# EAGLE design Attenumults_Rev 6 (EAGLE 8.2.2)
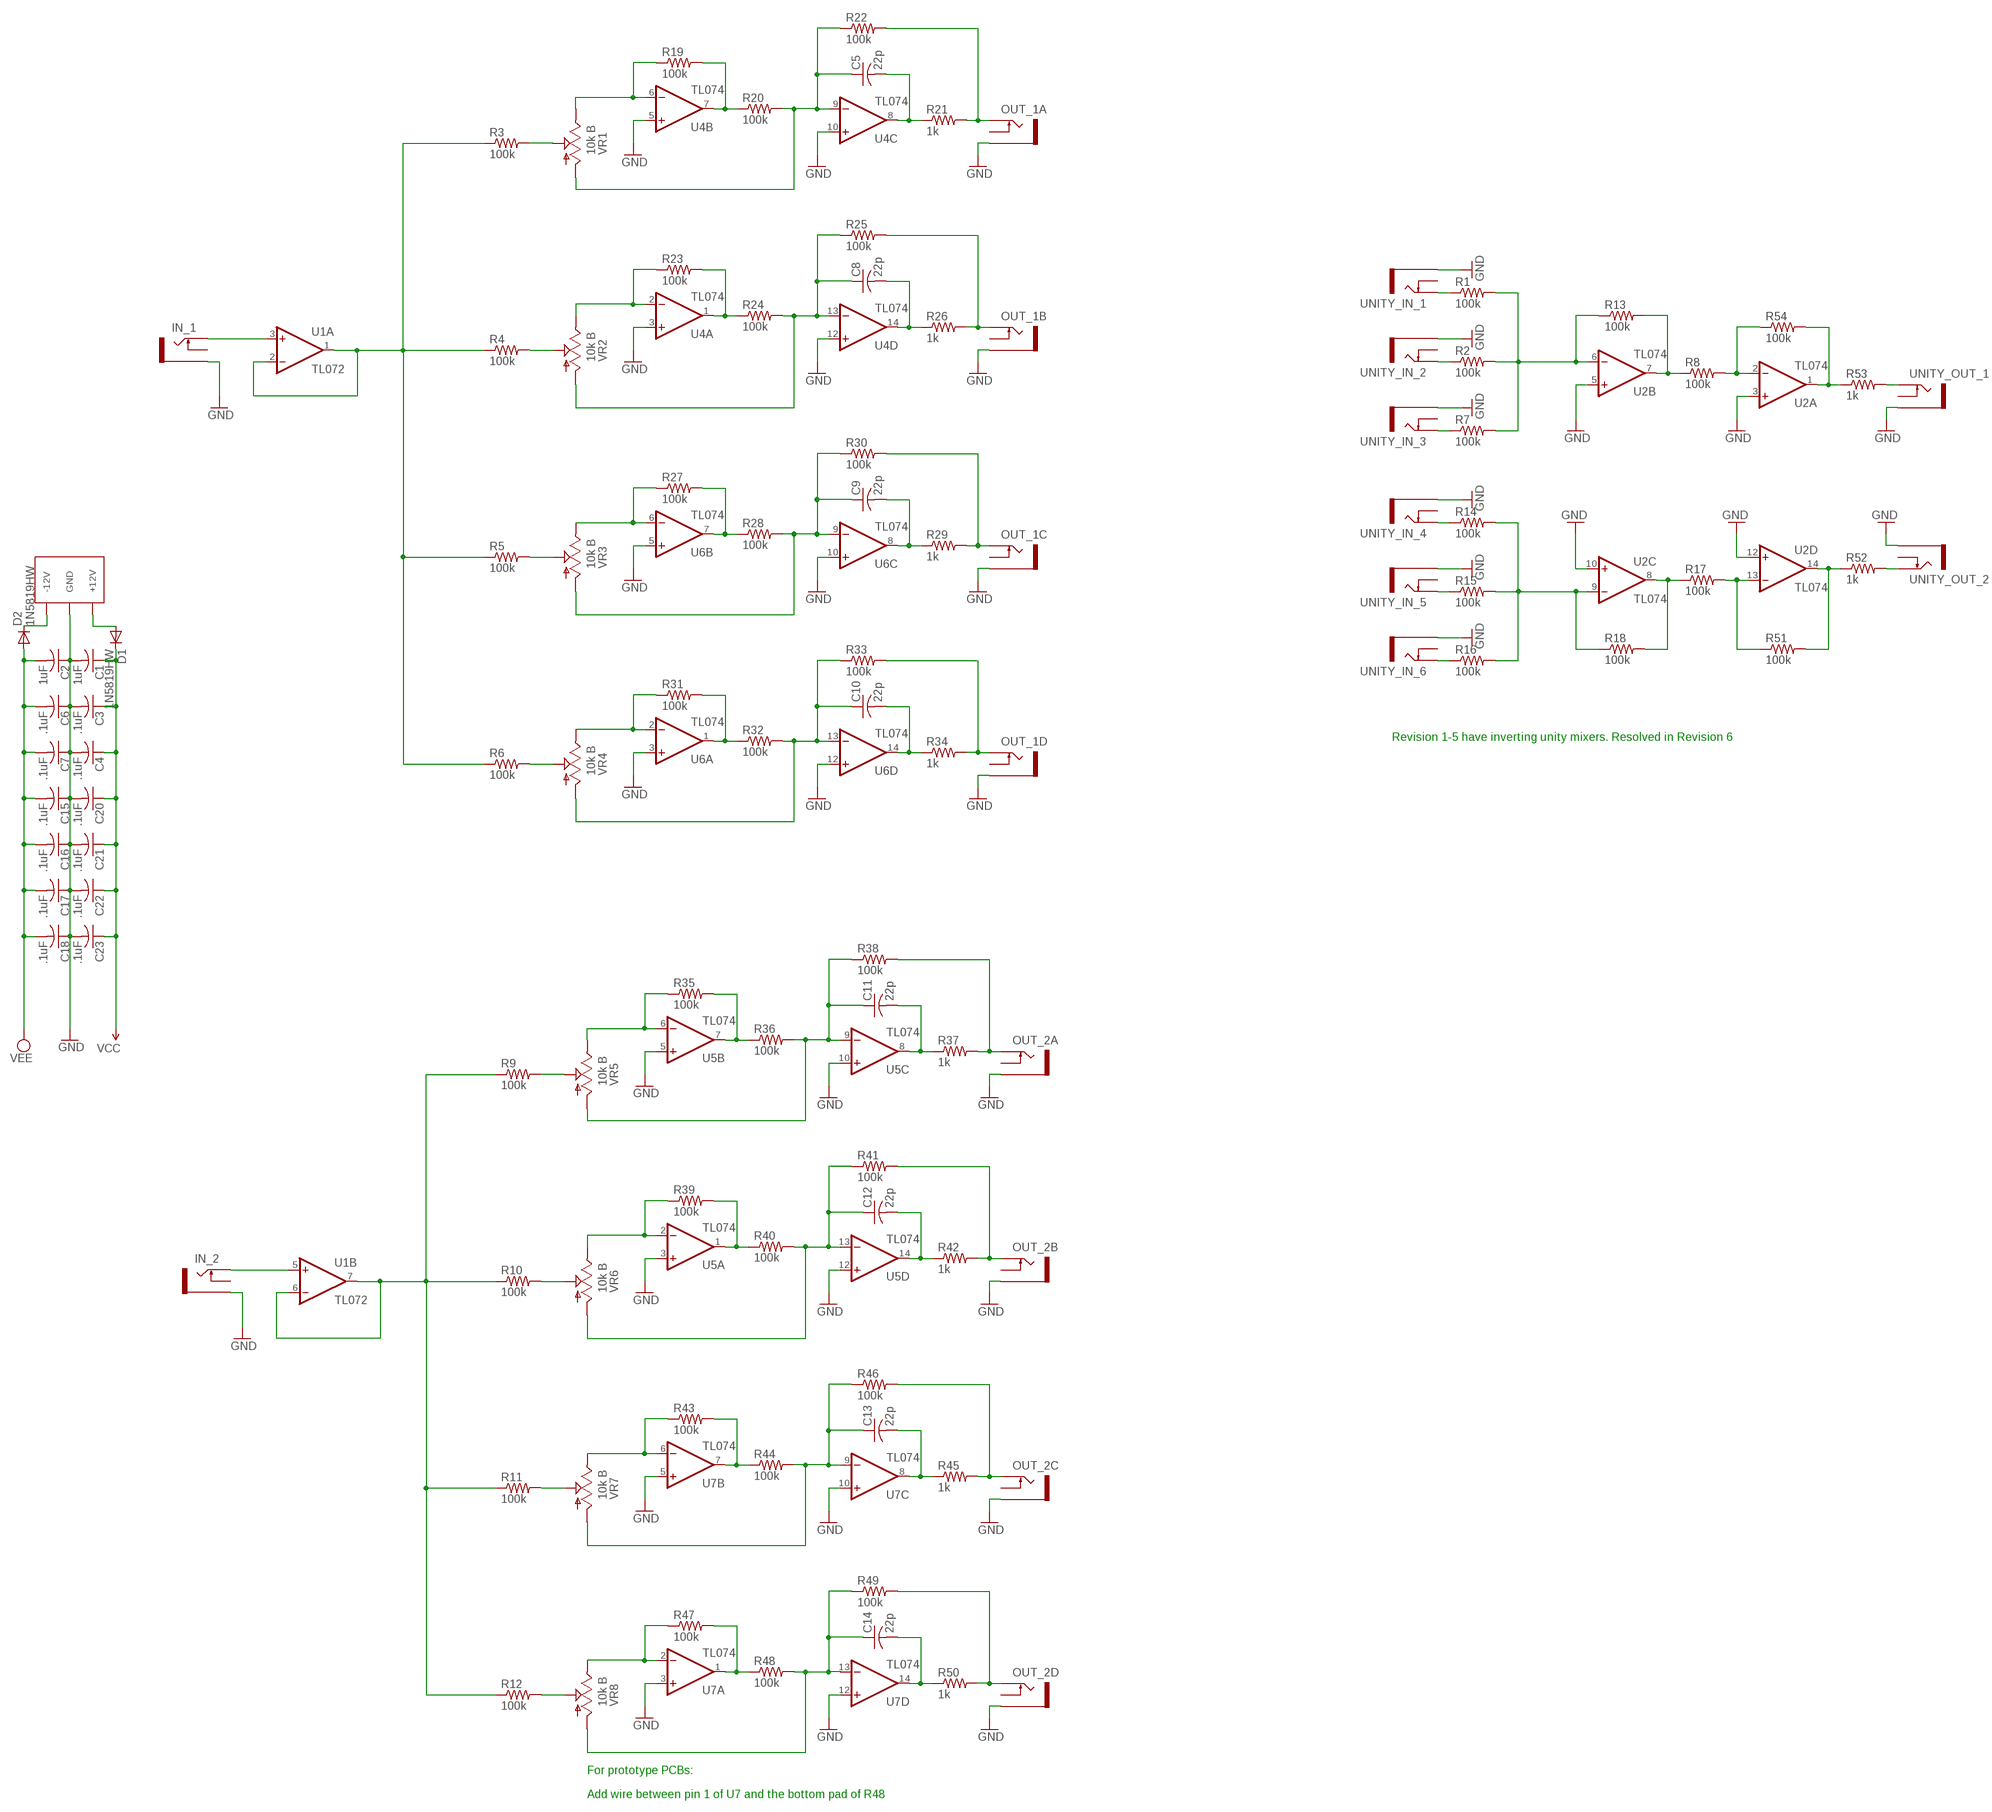
[diagram p0: schematic, sheet 1]

## Parts
C1  1uF  C-USC0805  [C0805]
C2  1uF  C-USC0805  [C0805]
C3  .1uF  C-USC0805  [C0805]
C4  .1uF  C-USC0805  [C0805]
C5  22p  C-USC0805  [C0805]
C6  .1uF  C-USC0805  [C0805]
C7  .1uF  C-USC0805  [C0805]
C8  22p  C-USC0805  [C0805]
C9  22p  C-USC0805  [C0805]
C10  22p  C-USC0805  [C0805]
C11  22p  C-USC0805  [C0805]
C12  22p  C-USC0805  [C0805]
C13  22p  C-USC0805  [C0805]
C14  22p  C-USC0805  [C0805]
C15  .1uF  C-USC0805  [C0805]
C16  .1uF  C-USC0805  [C0805]
C17  .1uF  C-USC0805  [C0805]
C18  .1uF  C-USC0805  [C0805]
C20  .1uF  C-USC0805  [C0805]
C21  .1uF  C-USC0805  [C0805]
C22  .1uF  C-USC0805  [C0805]
C23  .1uF  C-USC0805  [C0805]
D1  1N5819HW  DIODE-SOD123  [SOD123]
D2  1N5819HW  DIODE-SOD123  [SOD123]
IN_1  THONKICONNNEW  [WQP-PJ301M-12_JACK]
IN_2  THONKICONNNEW  [WQP-PJ301M-12_JACK]
OUT_1A  THONKICONNNEW  [WQP-PJ301M-12_JACK]
OUT_1B  THONKICONNNEW  [WQP-PJ301M-12_JACK]
OUT_1C  THONKICONNNEW  [WQP-PJ301M-12_JACK]
OUT_1D  THONKICONNNEW  [WQP-PJ301M-12_JACK]
OUT_2A  THONKICONNNEW  [WQP-PJ301M-12_JACK]
OUT_2B  THONKICONNNEW  [WQP-PJ301M-12_JACK]
OUT_2C  THONKICONNNEW  [WQP-PJ301M-12_JACK]
OUT_2D  THONKICONNNEW  [WQP-PJ301M-12_JACK]
R1  100k  R-US_R0805  [R0805]
R2  100k  R-US_R0805  [R0805]
R3  100k  R-US_R0805  [R0805]
R4  100k  R-US_R0805  [R0805]
R5  100k  R-US_R0805  [R0805]
R6  100k  R-US_R0805  [R0805]
R7  100k  R-US_R0805  [R0805]
R8  100k  R-US_R0805  [R0805]
R9  100k  R-US_R0805  [R0805]
R10  100k  R-US_R0805  [R0805]
R11  100k  R-US_R0805  [R0805]
R12  100k  R-US_R0805  [R0805]
R13  100k  R-US_R0805  [R0805]
R14  100k  R-US_R0805  [R0805]
R15  100k  R-US_R0805  [R0805]
R16  100k  R-US_R0805  [R0805]
R17  100k  R-US_R0805  [R0805]
R18  100k  R-US_R0805  [R0805]
R19  100k  R-US_R0805  [R0805]
R20  100k  R-US_R0805  [R0805]
R21  1k  R-US_R0805  [R0805]
R22  100k  R-US_R0805  [R0805]
R23  100k  R-US_R0805  [R0805]
R24  100k  R-US_R0805  [R0805]
R25  100k  R-US_R0805  [R0805]
R26  1k  R-US_R0805  [R0805]
R27  100k  R-US_R0805  [R0805]
R28  100k  R-US_R0805  [R0805]
R29  1k  R-US_R0805  [R0805]
R30  100k  R-US_R0805  [R0805]
R31  100k  R-US_R0805  [R0805]
R32  100k  R-US_R0805  [R0805]
R33  100k  R-US_R0805  [R0805]
R34  1k  R-US_R0805  [R0805]
R35  100k  R-US_R0805  [R0805]
R36  100k  R-US_R0805  [R0805]
R37  1k  R-US_R0805  [R0805]
R38  100k  R-US_R0805  [R0805]
R39  100k  R-US_R0805  [R0805]
R40  100k  R-US_R0805  [R0805]
R41  100k  R-US_R0805  [R0805]
R42  1k  R-US_R0805  [R0805]
R43  100k  R-US_R0805  [R0805]
R44  100k  R-US_R0805  [R0805]
R45  1k  R-US_R0805  [R0805]
R46  100k  R-US_R0805  [R0805]
R47  100k  R-US_R0805  [R0805]
R48  100k  R-US_R0805  [R0805]
R49  100k  R-US_R0805  [R0805]
R50  1k  R-US_R0805  [R0805]
R51  100k  R-US_R0805  [R0805]
R52  1k  R-US_R0805  [R0805]
R53  1k  R-US_R0805  [R0805]
R54  100k  R-US_R0805  [R0805]
U1  TL072  TL072_SMD  [SO08]
U2  TL074  TL074_SMD  [SO14]
U4  TL074  TL074_SMD  [SO14]
U5  TL074  TL074_SMD  [SO14]
U6  TL074  TL074_SMD  [SO14]
U7  TL074  TL074_SMD  [SO14]
U$1  EURO_POWER_LOCK  [EURO_PWR_HEADER_LOCK]
UNITY_IN_1  THONKICONNNEW  [WQP-PJ301M-12_JACK]
UNITY_IN_2  THONKICONNNEW  [WQP-PJ301M-12_JACK]
UNITY_IN_3  THONKICONNNEW  [WQP-PJ301M-12_JACK]
UNITY_IN_4  THONKICONNNEW  [WQP-PJ301M-12_JACK]
UNITY_IN_5  THONKICONNNEW  [WQP-PJ301M-12_JACK]
UNITY_IN_6  THONKICONNNEW  [WQP-PJ301M-12_JACK]
UNITY_OUT_1  THONKICONNNEW  [WQP-PJ301M-12_JACK]
UNITY_OUT_2  THONKICONNNEW  [WQP-PJ301M-12_JACK]
VR1  10k B  POT_USVERTICAL_PS  [ALPS_POT_VERTICAL_PS]
VR2  10k B  POT_USVERTICAL_PS  [ALPS_POT_VERTICAL_PS]
VR3  10k B  POT_USVERTICAL_PS  [ALPS_POT_VERTICAL_PS]
VR4  10k B  POT_USVERTICAL_PS  [ALPS_POT_VERTICAL_PS]
VR5  10k B  POT_USVERTICAL_PS  [ALPS_POT_VERTICAL_PS]
VR6  10k B  POT_USVERTICAL_PS  [ALPS_POT_VERTICAL_PS]
VR7  10k B  POT_USVERTICAL_PS  [ALPS_POT_VERTICAL_PS]
VR8  10k B  POT_USVERTICAL_PS  [ALPS_POT_VERTICAL_PS]

## Nets
GND: C1.2 C2.1 C3.2 C4.2 C6.1 C7.1 C15.1 C16.1 C17.1 C18.1 C20.2 C21.2 C22.2 C23.2 IN_1.P$3_SLEEVE(SLEEVE) IN_2.P$3_SLEEVE(SLEEVE) OUT_1A.P$3_SLEEVE(SLEEVE) OUT_1B.P$3_SLEEVE(SLEEVE) OUT_1C.P$3_SLEEVE(SLEEVE) OUT_1D.P$3_SLEEVE(SLEEVE) OUT_2A.P$3_SLEEVE(SLEEVE) OUT_2B.P$3_SLEEVE(SLEEVE) OUT_2C.P$3_SLEEVE(SLEEVE) OUT_2D.P$3_SLEEVE(SLEEVE) U2.3(A:+IN) U2.5(B:+IN) U2.10(C:+IN) U2.12(D:+IN) U4.3(A:+IN) U4.5(B:+IN) U4.10(C:+IN) U4.12(D:+IN) U5.3(A:+IN) U5.5(B:+IN) U5.10(C:+IN) U5.12(D:+IN) U6.3(A:+IN) U6.5(B:+IN) U6.10(C:+IN) U6.12(D:+IN) U7.3(A:+IN) U7.5(B:+IN) U7.10(C:+IN) U7.12(D:+IN) U$1.GND1(GND) U$1.GND2(GND) U$1.GND3(GND) U$1.GND4(GND) U$1.GND5(GND) U$1.GND6(GND) UNITY_IN_1.P$3_SLEEVE(SLEEVE) UNITY_IN_2.P$3_SLEEVE(SLEEVE) UNITY_IN_3.P$3_SLEEVE(SLEEVE) UNITY_IN_4.P$3_SLEEVE(SLEEVE) UNITY_IN_5.P$3_SLEEVE(SLEEVE) UNITY_IN_6.P$3_SLEEVE(SLEEVE) UNITY_OUT_1.P$3_SLEEVE(SLEEVE) UNITY_OUT_2.P$3_SLEEVE(SLEEVE)
N$1: IN_1.P$1_TIP(TIP) U1.3(A:+IN)
N$2: R3.2 VR1.P$2(S)
N$3: R19.1 U4.6(B:-IN) VR1.P$1(E)
N$4: R3.1 R4.1 R5.1 R6.1 U1.1(A:OUT) U1.2(A:-IN)
N$5: R1.2 R2.2 R7.2 R13.1 U2.6(B:-IN)
N$6: IN_2.P$1_TIP(TIP) U1.5(B:+IN)
N$7: R19.2 R20.1 U4.7(B:OUT)
N$8: R9.1 R10.1 R11.1 R12.1 U1.6(B:-IN) U1.7(B:OUT)
N$9: C5.1 R20.2 R22.1 U4.9(C:-IN) VR1.P$3(A)
N$10: R8.2 R54.1 U2.2(A:-IN)
N$11: C5.2 R21.1 U4.8(C:OUT)
N$12: OUT_1A.P$1_TIP(TIP) R21.2 R22.2
N$13: R4.2 VR2.P$2(S)
N$14: R23.1 U4.2(A:-IN) VR2.P$1(E)
N$15: R7.1 UNITY_IN_3.P$1_TIP(TIP)
N$16: R53.1 R54.2 U2.1(A:OUT)
N$17: R53.2 UNITY_OUT_1.P$1_TIP(TIP)
N$18: R17.2 R51.1 U2.13(D:-IN)
N$19: R51.2 R52.1 U2.14(D:OUT)
N$20: R52.2 UNITY_OUT_2.P$1_TIP(TIP)
N$21: R9.2 VR5.P$2(S)
N$22: R23.2 R24.1 U4.1(A:OUT)
N$23: R35.1 U5.6(B:-IN) VR5.P$1(E)
N$24: C8.1 R24.2 R25.1 U4.13(D:-IN) VR2.P$3(A)
N$25: R35.2 R36.1 U5.7(B:OUT)
N$26: C8.2 R26.1 U4.14(D:OUT)
N$27: C11.1 R36.2 R38.1 U5.9(C:-IN) VR5.P$3(A)
N$28: OUT_1B.P$1_TIP(TIP) R25.2 R26.2
N$29: R2.1 UNITY_IN_2.P$1_TIP(TIP)
N$30: R1.1 UNITY_IN_1.P$1_TIP(TIP)
N$32: R8.1 R13.2 U2.7(B:OUT)
N$33: R17.1 R18.2 U2.8(C:OUT)
N$35: R14.2 R15.2 R16.2 R18.1 U2.9(C:-IN)
N$36: R16.1 UNITY_IN_6.P$1_TIP(TIP)
N$37: R15.1 UNITY_IN_5.P$1_TIP(TIP)
N$38: R14.1 UNITY_IN_4.P$1_TIP(TIP)
N$39: D1.A U$1.POS1(+12V) U$1.POS2(+12V)
N$40: D2.C U$1.NEG1(-12V) U$1.NEG2(-12V)
N$41: R27.1 U6.6(B:-IN) VR3.P$1(E)
N$42: R27.2 R28.1 U6.7(B:OUT)
N$43: C9.1 R28.2 R30.1 U6.9(C:-IN) VR3.P$3(A)
N$44: C9.2 R29.1 U6.8(C:OUT)
N$45: OUT_1C.P$1_TIP(TIP) R29.2 R30.2
N$46: R31.1 U6.2(A:-IN) VR4.P$1(E)
N$47: R31.2 R32.1 U6.1(A:OUT)
N$48: C10.1 R32.2 R33.1 U6.13(D:-IN) VR4.P$3(A)
N$49: C10.2 R34.1 U6.14(D:OUT)
N$50: OUT_1D.P$1_TIP(TIP) R33.2 R34.2
N$51: C11.2 R37.1 U5.8(C:OUT)
N$52: R6.2 VR4.P$2(S)
N$53: R5.2 VR3.P$2(S)
N$54: OUT_2A.P$1_TIP(TIP) R37.2 R38.2
N$55: R10.2 VR6.P$2(S)
N$56: R39.1 U5.2(A:-IN) VR6.P$1(E)
N$57: R39.2 R40.1 U5.1(A:OUT)
N$58: C12.1 R40.2 R41.1 U5.13(D:-IN) VR6.P$3(A)
N$59: C12.2 R42.1 U5.14(D:OUT)
N$60: OUT_2B.P$1_TIP(TIP) R41.2 R42.2
N$61: R43.1 U7.6(B:-IN) VR7.P$1(E)
N$62: R43.2 R44.1 U7.7(B:OUT)
N$63: C13.1 R44.2 R46.1 U7.9(C:-IN) VR7.P$3(A)
N$64: C13.2 R45.1 U7.8(C:OUT)
N$65: OUT_2C.P$1_TIP(TIP) R45.2 R46.2
N$66: R47.1 U7.2(A:-IN) VR8.P$1(E)
N$67: R47.2 R48.1 U7.1(A:OUT)
N$68: C14.1 R48.2 R49.1 U7.13(D:-IN) VR8.P$3(A)
N$69: C14.2 R50.1 U7.14(D:OUT)
N$70: OUT_2D.P$1_TIP(TIP) R49.2 R50.2
N$71: R12.2 VR8.P$2(S)
N$72: R11.2 VR7.P$2(S)
V+: C1.1 C3.1 C4.1 C20.1 C21.1 C22.1 C23.1 D1.C ; supply symbol labelled VCC
V-: C2.2 C6.2 C7.2 C15.2 C16.2 C17.2 C18.2 D2.A ; supply symbol labelled VEE
Unconnected: IN_1.P$2_SWITCH(SWITCH) IN_2.P$2_SWITCH(SWITCH) OUT_1A.P$2_SWITCH(SWITCH) OUT_1B.P$2_SWITCH(SWITCH) OUT_1C.P$2_SWITCH(SWITCH) OUT_1D.P$2_SWITCH(SWITCH) OUT_2A.P$2_SWITCH(SWITCH) OUT_2B.P$2_SWITCH(SWITCH) OUT_2C.P$2_SWITCH(SWITCH) OUT_2D.P$2_SWITCH(SWITCH) UNITY_IN_1.P$2_SWITCH(SWITCH) UNITY_IN_2.P$2_SWITCH(SWITCH) UNITY_IN_3.P$2_SWITCH(SWITCH) UNITY_IN_4.P$2_SWITCH(SWITCH) UNITY_IN_5.P$2_SWITCH(SWITCH) UNITY_IN_6.P$2_SWITCH(SWITCH) UNITY_OUT_1.P$2_SWITCH(SWITCH) UNITY_OUT_2.P$2_SWITCH(SWITCH)

## Notes on the sheet
- Revision 1-5 have inverting unity mixers. Resolved in Revision 6
- For prototype PCBs:
  
  Add wire between pin 1 of U7 and the bottom pad of R48

## Power pins joined to a net without a drawn wire
V+: U1.8(P:V+) U2.4(P:V+) U4.4(P:V+) U5.4(P:V+) U6.4(P:V+) U7.4(P:V+)
V-: U1.4(P:V-) U2.11(P:V-) U4.11(P:V-) U5.11(P:V-) U6.11(P:V-) U7.11(P:V-)

## Library data of the parts
C1-C18 C20-C23 = rcl:C-US: CAPACITOR, American symbol
D1 D2 = diode:DIODE-: DIODE
IN_1 IN_2 OUT_1A OUT_1B OUT_1C OUT_1D OUT_2A OUT_2B OUT_2C OUT_2D UNITY_IN_1-UNITY_IN_6 UNITY_OUT_1 UNITY_OUT_2 = MusicThingModular:THONKICONN: 3.5mm socket for Eurorack modular synths
R1-R54 = resistor:R-US_: RESISTOR, American symbol
U1 = MusicThingModular:TL072: Generic Dual Op Amp
U2 U4-U7 = MusicThingModular:TL074: Generic Quad Op Amp
U$1 = MusicThingModular:EURO_POWER_LOCK
VR1-VR8 = pot-alps:POT_US

## Board
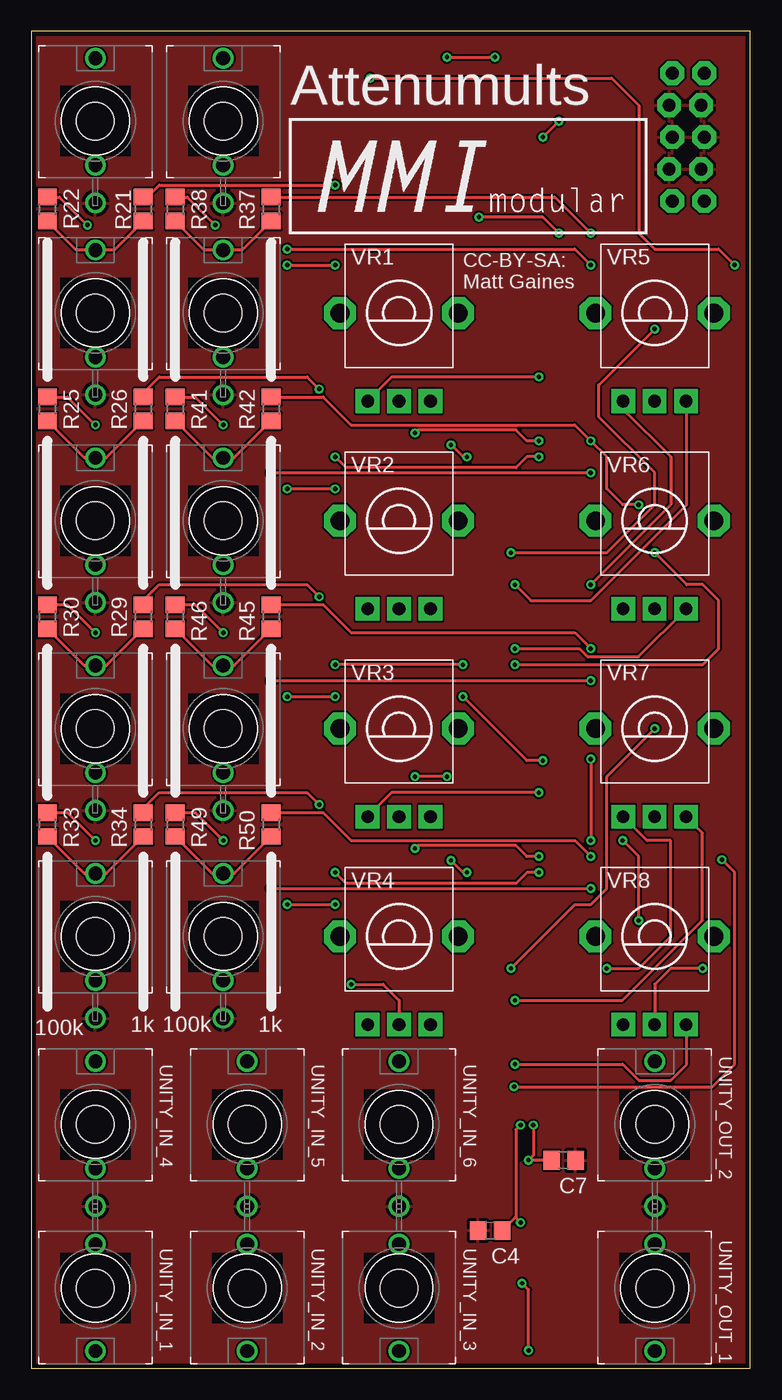
[diagram p1: board, top side]
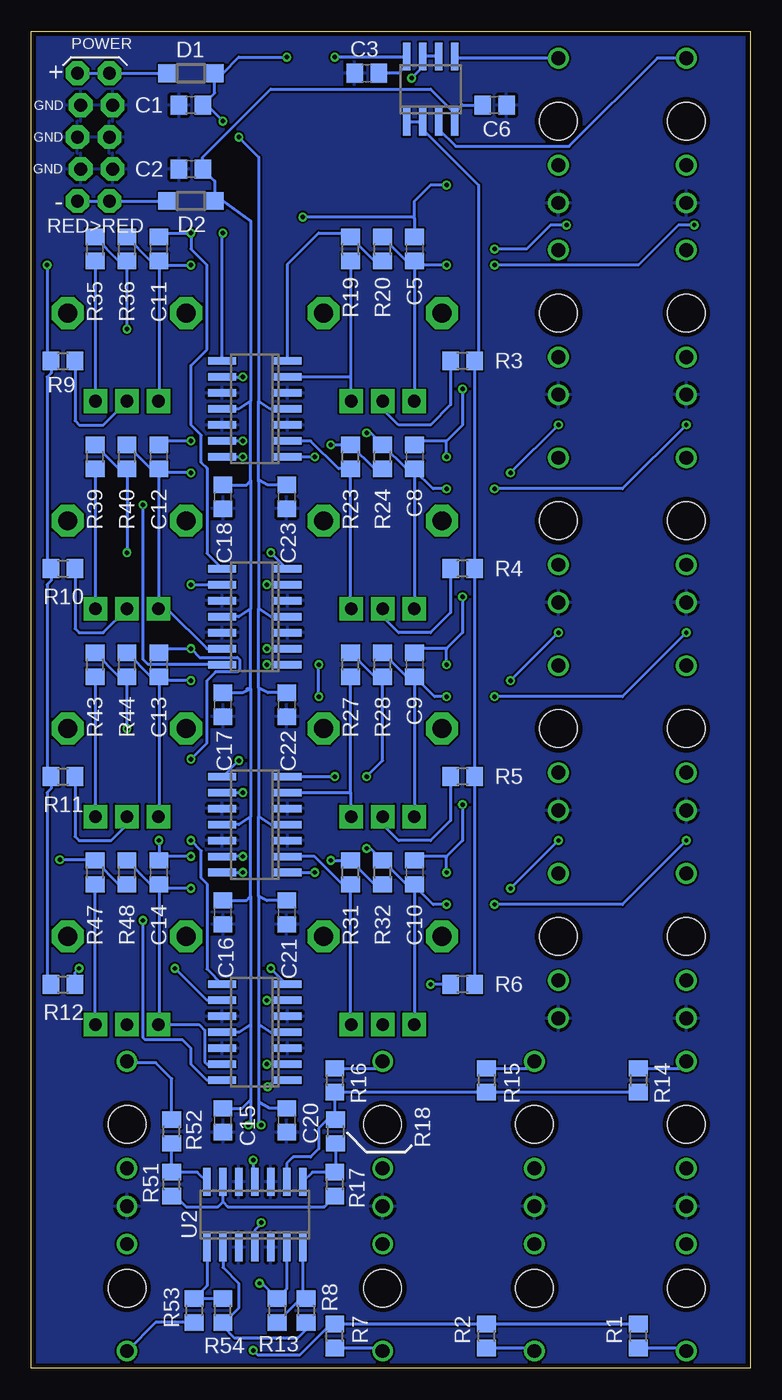
[diagram p2: board, bottom side, seen from below]

Size 57.12 x 106.18 mm. Coordinates in mm from the lower left corner, seen from the top.
Outline: 0,0 57.12,0 57.12,106.18 0,106.18 0,0
Copper layers (1*16): Top 0.0356mm / dielectric 1.5011mm / Bottom 0.0356mm
Design rules "oshpark-2layer": minimum track width 6mil, minimum drill 13mil, track to track 6mil, track to pad 6mil, pad to pad 6mil, via to via 6mil, smd to smd 6mil, copper to edge 15mil, drill to drill 6mil, minimum pad ring 7mil, minimum via ring 7mil, stop-mask expansion 2.5mil, vias tented up to drill 0mil, thermal gap 10mil
Holes 3 mm at 5.08,99.06 15.24,99.06 15.24,83.82 5.08,83.82 5.08,67.31 15.24,67.31 15.24,50.8 5.08,50.8 5.08,34.29 15.24,34.29 5.08,6.35 17.14,6.35 29.21,6.35 49.53,6.35 49.53,19.35 29.21,19.35 17.14,19.35 5.08,19.35

### Footprints (pad centres in the part's own frame; a part is rotated, then mirrored left to right if it is on the bottom)
C0805 = smd 1.3 x 1.5: 1 -0.95,0; 2 0.95,0
SOD123 = smd 1.4 x 1.4: A 1.9,0; C -1.9,0
WQP-PJ301M-12_JACK = drill 1.1: P$1_TIP 0,5; P$2_SWITCH 0,-3.5; P$3_SLEEVE 0,-6.5
R0805 = smd 1.3 x 1.5: 1 -0.95,0; 2 0.95,0
SO08 = smd 0.6 x 2.2: 1 -1.905,-2.6; 2 -0.635,-2.6; 3 0.635,-2.6; 4 1.905,-2.6; 5 1.905,2.6; 6 0.635,2.6; 7 -0.635,2.6; 8 -1.905,2.6
SO14 = smd 0.6 x 2.2: 1 -3.81,-2.6; 2 -2.54,-2.6; 3 -1.27,-2.6; 4 0,-2.6; 5 1.27,-2.6; 6 2.54,-2.6; 7 3.81,-2.6; 8 3.81,2.6; 9 2.54,2.6; 10 1.27,2.6; 11 0,2.6; 12 -1.27,2.6; 13 -2.54,2.6; 14 -3.81,2.6
EURO_PWR_HEADER_LOCK = drill 1.016 pad 1.88 octagon: GND1 -2.54,1.143; GND2 -2.54,-1.397; GND3 0,1.397; GND4 0,-1.143; GND5 2.54,1.143; GND6 2.54,-1.397; NEG1 -5.08,1.397; NEG2 -5.08,-1.143; POS1 5.08,1.397; POS2 5.08,-1.143
ALPS_POT_VERTICAL_PS = drill 1 pad 1.88 square: P$1 -2.5,7; P$2 0,7; P$3 2.5,7 | drill 1.5 pad 2.54 octagon: P$4 -4.7,0; P$5 4.7,0

### Placement (x,y rotation side)
C1  44.45,100.33 180 bottom
C2  44.45,95.25 0 bottom
C3  30.48,102.87 180 bottom
C4  36.45,10.92 180 top
C5  26.67,88.9 90 bottom
C6  20.32,100.33 180 bottom
C7  42.29,16.51 180 top
C8  26.67,72.39 90 bottom
C9  26.67,55.88 90 bottom
C10  26.67,39.37 90 bottom
C11  46.99,88.9 90 bottom
C12  46.99,72.39 90 bottom
C13  46.99,55.88 90 bottom
C14  46.99,39.37 90 bottom
C15  41.91,19.68 90 bottom
C16  41.91,36.2 90 bottom
C17  41.91,52.7 90 bottom
C18  41.91,69.22 90 bottom
C20  36.83,19.68 270 bottom
C21  36.83,36.2 270 bottom
C22  36.83,52.7 270 bottom
C23  36.83,69.22 270 bottom
D1  44.45,102.87 180 bottom
D2  44.45,92.71 0 bottom
IN_1  5.08,99.06 0 top
IN_2  15.24,99.06 0 top
OUT_1A  5.08,83.82 0 top
OUT_1B  5.08,67.31 0 top
OUT_1C  5.08,50.8 0 top
OUT_1D  5.08,34.29 0 top
OUT_2A  15.24,83.82 0 top
OUT_2B  15.24,67.31 0 top
OUT_2C  15.24,50.8 0 top
OUT_2D  15.24,34.29 0 top
R1  8.89,2.54 90 bottom
R2  20.95,2.54 90 bottom
R3  22.86,80.01 180 bottom
R4  22.86,63.5 180 bottom
R5  22.86,46.99 180 bottom
R6  22.86,30.48 180 bottom
R7  33.02,2.54 90 bottom
R8  35.31,4.57 270 bottom
R9  54.61,80.01 0 bottom
R10  54.61,63.5 0 bottom
R11  54.61,46.99 0 bottom
R12  54.61,30.48 0 bottom
R13  37.59,4.57 270 bottom
R14  8.89,22.86 270 bottom
R15  20.95,22.86 270 bottom
R16  33.02,22.86 270 bottom
R17  33.02,14.61 270 bottom
R18  32.96,18.8 270 bottom
R19  31.75,88.9 90 bottom
R20  29.21,88.9 90 bottom
R21  8.89,92.08 270 top
R22  1.27,92.08 270 top
R23  31.75,72.39 90 bottom
R24  29.21,72.39 90 bottom
R25  1.27,76.2 270 top
R26  8.89,76.2 270 top
R27  31.75,55.88 90 bottom
R28  29.21,55.88 90 bottom
R29  8.89,59.69 270 top
R30  1.27,59.69 270 top
R31  31.75,39.37 90 bottom
R32  29.21,39.37 90 bottom
R33  1.27,43.18 270 top
R34  8.89,43.18 270 top
R35  52.07,88.9 90 bottom
R36  49.53,88.9 90 bottom
R37  19.05,92.08 270 top
R38  11.43,92.08 270 top
R39  52.07,72.39 90 bottom
R40  49.53,72.39 90 bottom
R41  11.43,76.2 270 top
R42  19.05,76.2 270 top
R43  52.07,55.88 90 bottom
R44  49.53,55.88 90 bottom
R45  19.05,59.69 270 top
R46  11.43,59.69 270 top
R47  52.07,39.37 90 bottom
R48  49.53,39.37 90 bottom
R49  11.43,43.18 270 top
R50  19.05,43.18 270 top
R51  45.97,14.61 90 bottom
R52  45.97,18.8 90 bottom
R53  44.2,4.57 270 bottom
R54  41.91,4.57 90 bottom
U1  25.4,101.6 0 bottom
U2  39.37,12.19 0 bottom
U4  39.37,76.2 90 bottom
U5  39.37,59.69 90 bottom
U6  39.37,43.18 90 bottom
U7  39.37,26.67 90 bottom
U$1  52.07,97.79 90 bottom
UNITY_IN_1  5.08,6.35 180 top
UNITY_IN_2  17.14,6.35 180 top
UNITY_IN_3  29.21,6.35 180 top
UNITY_IN_4  5.08,19.35 0 top
UNITY_IN_5  17.14,19.35 0 top
UNITY_IN_6  29.21,19.35 0 top
UNITY_OUT_1  49.53,6.35 180 top
UNITY_OUT_2  49.53,19.35 0 top
VR1  29.21,83.82 180 top
VR2  29.21,67.31 180 top
VR3  29.21,50.8 180 top
VR4  29.21,34.29 180 top
VR5  49.53,83.82 180 top
VR6  49.53,67.31 180 top
VR7  49.53,50.8 180 top
VR8  49.53,34.29 180 top

### Tracks (layer width: path | path; a pad name or v marks a point on that pad's centre or on a via)
GND
  pour Top: 0,0 57.15,0 57.15,106.05 0,106.05
  pour Bottom: 0,106.05 57.15,106.05 57.15,0 0,0
N$1
  Bottom 0.254: IN_1.P$1_TIP 7.4,104.06 14.41,97.05 23.39,97.05 24.77,98.42 U1.3
N$2
  Bottom 0.254: R3.2 23.81,76.52 25.4,74.93 27.94,74.93 29.21,76.2 VR1.P$2
N$3
  Bottom 0.254: R19.1 31.75,78.74 | 31.75,78.74 31.75,76.86 VR1.P$1 | 31.75,78.74 U4.6
N$4
  Bottom 0.254: U1.1 U1.2 26.04,98.42 21.59,93.98 21.59,80.33 R3.1 R4.1 R5.1 R6.1
N$5  (via drill 0.35)
  Top 0.254: v39.5,1.4 39.5,6.22 v38.99,6.73
  Bottom 0.254: R1.2 R2.2 R7.2 33.34,3.49 35.81,1.02 39.12,1.02 v39.5,1.4 | U2.6 36.83,6.28 R13.1 38.8,6.73 v38.99,6.73
N$6
  Bottom 0.254: IN_2.P$1_TIP 23.36,104.06 U1.5
N$7
  Bottom 0.254: R20.1 29.85,87.95 R19.2 32.07,90.17 34.29,90.17 36.77,87.69 U4.7
N$8  (via drill 0.35)
  Top 0.254: v26.91,102.48 46.11,102.48 48.26,100.33 48.26,90.17 49.53,88.9 54.61,88.9 v55.88,87.63
  Bottom 0.254: U1.6 U1.7 26.04,103.36 v26.91,102.48 | v55.88,87.63 55.88,80.33 R9.1 55.56,79.06 55.88,78.74 55.88,63.82 R10.1 55.56,62.55 55.88,62.23 55.88,47.31 R11.1 55.56,46.04 55.88,45.72 55.88,30.8 R12.1
N$9  (via drill 0.35)
  Top 0.254: R22.1 2.23,93.03 v4.45,90.81 | v20.32,87.63 v24.13,87.63 | v40.32,78.74 28.63,78.74 VR1.P$3
  Bottom 0.254: C5.1 27.31,87.95 R20.2 | C5.1 26.67,76.86 VR1.P$3 | v4.45,90.81 5.71,90.81 8.89,87.63 v20.32,87.63 | v24.13,87.63 26.35,87.63 C5.1 | U4.9 v40.32,78.74
N$10
  Bottom 0.254: R8.2 35.31,3.05 35.94,2.41 41.02,2.41 41.91,3.3 41.91,3.5 | 41.91,3.5 R54.1 | U2.2 41.91,8 40.64,6.73 40.64,4.77 41.91,3.5
N$11  (via drill 0.35)
  Top 0.254: R21.1 9.21,93.03 10.16,93.98 v24.13,93.98 | v41.91,90.17 40.64,91.44 v35.56,91.44
  Bottom 0.254: v24.13,93.98 25.4,93.98 26.67,92.71 26.67,91.31 | 26.67,91.31 C5.2 | v35.56,91.44 26.8,91.44 26.67,91.31 | U4.8 41.97,90.11 v41.91,90.17
N$12
  Top 0.254: R21.2 6.58,88.82 OUT_1A.P$1_TIP 3.58,88.82 R22.2
N$13
  Bottom 0.254: R4.2 23.81,60.01 25.4,58.42 27.94,58.42 29.21,59.69 VR2.P$2
N$14
  Bottom 0.254: VR2.P$1 31.75,60.35 R23.1 32.7,71.44 34.92,73.66 U4.2
N$15
  Bottom 0.254: R7.1 29.45,1.59 UNITY_IN_3.P$1_TIP
N$16
  Bottom 0.254: R54.2 R53.1 43.18,6.54 U2.1
N$17
  Bottom 0.254: R53.2 47.26,3.62 UNITY_OUT_1.P$1_TIP
N$18
  Bottom 0.254: R51.1 45.66,13.65 44.83,12.83 42.29,12.83 41.91,13.21 | 41.91,13.21 U2.13 | 41.91,13.21 41.53,12.83 33.85,12.83 R17.2
N$19
  Bottom 0.254: U2.14 43.94,15.55 R51.2 R52.1
N$20
  Bottom 0.254: R52.2 45.97,22.99 47.24,24.26 49.43,24.26 UNITY_OUT_2.P$1_TIP
N$21
  Bottom 0.254: R9.2 53.66,75.25 53.34,74.93 51.42,74.93 VR5.P$2
N$22  (via drill 0.35)
  Top 0.254: v34.61,72.39 34.29,72.39 v33.34,73.34
  Bottom 0.254: R24.1 29.85,71.44 R23.2 v33.34,73.34 | U4.1 v34.61,72.39
N$23  (via drill 0.35)
  Top 0.254: v38.42,62.23 39.69,60.96 44.45,60.96 52.07,68.58 52.07,76.78 VR5.P$1
  Bottom 0.254: R35.1 52.07,76.86 VR5.P$1 | U5.6 v38.42,62.23
N$24  (via drill 0.35)
  Top 0.254: R25.1 2.86,77.15 v5.08,74.93 | v20.32,69.85 v24.13,69.85 | v40.32,73.66 39.37,73.66 38.51,74.52 30.71,74.52 v30.48,74.3
  Bottom 0.254: 26.67,71.31 C8.1 27.31,71.44 R24.2 30.17,74.3 v30.48,74.3 | 26.67,71.31 26.67,60.35 VR2.P$3 | v5.08,74.93 10.16,69.85 v20.32,69.85 | v24.13,69.85 25.21,69.85 26.67,71.31 | v40.32,73.66 U4.13
N$25  (via drill 0.35)
  Top 0.254: v38.1,64.77 45.72,64.77 49.53,68.58 49.53,71.12 45.09,75.56 45.09,78.11 v49.53,82.55
  Bottom 0.254: R35.2 50.17,87.95 R36.1 v49.53,82.55 | U5.7 36.83,63.5 v38.1,64.77
N$26  (via drill 0.35)
  Top 0.254: R26.1 8.89,77.47 10.16,78.74 21.9,78.74 v22.86,77.78 | v40.32,72.39 39.37,72.39 38.51,71.53 24.99,71.53 v24.13,72.39
  Bottom 0.254: v22.86,77.78 22.86,74.93 24.13,73.66 | 24.13,73.66 26.35,73.66 C8.2 | U4.14 v40.32,72.39 | v24.13,72.39 24.13,73.66
N$27  (via drill 0.35)
  Top 0.254: R38.1 12.38,93.03 v14.61,90.81 | v20.32,88.9 43.18,88.9 v44.45,87.63 | VR5.P$3 47.03,76.16 50.8,72.39 50.8,68.58 v44.45,62.23
  Bottom 0.254: R36.2 47.63,87.95 C11.1 46.99,87.82 | 46.99,87.82 46.99,76.86 VR5.P$3 | v14.61,90.81 15.88,90.81 17.78,88.9 v20.32,88.9 | v44.45,87.63 46.8,87.63 46.99,87.82 | v44.45,62.23 U5.9
N$28
  Top 0.254: R26.2 5.95,72.31 OUT_1B.P$1_TIP 4.21,72.31 R25.2
N$29
  Bottom 0.254: R2.1 17.39,1.59 UNITY_IN_2.P$1_TIP
N$30
  Bottom 0.254: R1.1 5.32,1.59 UNITY_IN_1.P$1_TIP
N$32
  Bottom 0.254: U2.7 35.56,5.78 R8.1 35.69,5.52 R13.2
N$33
  Bottom 0.254: R18.2 32.96,15.62 R17.1 34.8,15.55 U2.8
N$35
  Bottom 0.254: R14.2 R15.2 R16.2 33.02,19.81 R18.1 33.59,19.75 34.29,19.05 34.29,17.4 34.92,16.76 36.32,16.76 36.83,16.26 U2.9
N$36
  Bottom 0.254: R16.1 29.75,23.81 UNITY_IN_6.P$1_TIP
N$37
  Bottom 0.254: R15.1 17.69,23.81 UNITY_IN_5.P$1_TIP
N$38
  Bottom 0.254: R14.1 5.62,23.81 UNITY_IN_4.P$1_TIP
N$39
  Bottom 0.254: U$1.POS1 U$1.POS2 D1.A
N$40
  Bottom 0.254: U$1.NEG1 U$1.NEG2 D2.C
N$41
  Bottom 0.254: 31.75,45.69 31.75,43.84 VR3.P$1 | 31.75,45.69 R27.1 | U6.6 31.78,45.72 31.75,45.69
N$42  (via drill 0.35)
  Top 0.254: v33.02,46.99 v30.48,46.99
  Bottom 0.254: R27.2 29.85,54.93 R28.1 29.21,48.26 v30.48,46.99 | U6.7 v33.02,46.99
N$43  (via drill 0.35)
  Top 0.254: R30.1 2.86,60.64 v5.08,58.42 | v20.32,53.34 v24.13,53.34 | v40.32,45.72 28.63,45.72 VR3.P$3
  Bottom 0.254: C9.1 27.31,54.93 R28.2 | v5.08,58.42 10.16,53.34 v20.32,53.34 | v24.13,53.34 25.08,53.34 C9.1 | C9.1 26.67,43.84 VR3.P$3 | U6.9 v40.32,45.72
N$44  (via drill 0.35)
  Top 0.254: R29.1 8.89,60.96 10.16,62.23 21.9,62.23 v22.86,61.27 | v40.64,48.26 39.37,48.26 v34.29,53.34 | v34.29,55.88 v24.13,55.88
  Bottom 0.254: v22.86,61.27 22.86,58.42 24.13,57.15 24.17,57.15 | 24.17,57.15 26.35,57.15 C9.2 | U6.8 41.91,46.99 v40.64,48.26 | v34.29,53.34 v34.29,55.88 | v24.13,55.88 24.13,57.11 24.17,57.15
N$45
  Top 0.254: R29.2 5.95,55.8 OUT_1C.P$1_TIP 4.21,55.8 R30.2
N$46
  Bottom 0.254: VR4.P$1 31.75,27.33 R31.1 32.39,38.42 34.61,40.64 U6.2
N$47  (via drill 0.35)
  Top 0.254: v34.61,39.37 34.29,39.37 v33.34,40.32
  Bottom 0.254: R32.1 29.85,38.42 R31.2 v33.34,40.32 | U6.1 v34.61,39.37
N$48  (via drill 0.35)
  Top 0.254: R33.1 2.86,44.13 v5.08,41.91 | v20.32,36.83 v24.13,36.83 | v40.32,40.64 39.37,40.64 38.51,41.5 30.71,41.5 v30.48,41.28
  Bottom 0.254: 26.67,38.3 26.67,27.33 VR4.P$3 | 26.67,38.3 C10.1 27.31,38.42 R32.2 30.17,41.28 v30.48,41.28 | v5.08,41.91 10.16,36.83 v20.32,36.83 | v24.13,36.83 25.2,36.83 26.67,38.3 | v40.32,40.64 U6.13
N$49  (via drill 0.35)
  Top 0.254: R34.1 8.89,44.45 10.16,45.72 21.9,45.72 v22.86,44.76 | v40.32,39.37 39.37,39.37 38.51,38.51 24.99,38.51 v24.13,39.37
  Bottom 0.254: v22.86,44.76 22.86,41.91 24.13,40.64 | 24.13,40.64 26.35,40.64 C10.2 | U6.14 v40.32,39.37 | v24.13,39.37 24.13,40.64
N$50
  Top 0.254: R34.2 5.95,39.29 OUT_1D.P$1_TIP 4.21,39.29 R33.2
N$51  (via drill 0.35)
  Top 0.254: R37.1 41.59,93.03 v44.45,90.17
  Bottom 0.254: C11.2 46.67,90.17 v44.45,90.17 44.45,88.9 43.18,87.63 43.18,80.91 44.45,79.64 44.45,74.93 43.63,74.11 43.63,71.94 | U5.8 43.18,64.71 43.18,71.49 43.63,71.94 | 43.67,71.97 43.63,71.94
N$52  (via drill 0.35)
  Top 0.254: v25.4,30.48 27.94,30.48 29.21,29.21 VR4.P$2
  Bottom 0.254: R6.2 v25.4,30.48
N$53
  Bottom 0.254: R5.2 23.81,43.5 25.4,41.91 27.94,41.91 29.21,43.18 VR3.P$2
N$54
  Top 0.254: R37.2 16.75,88.82 OUT_2A.P$1_TIP 13.73,88.82 R38.2
N$55
  Bottom 0.254: R10.2 53.66,58.74 53.34,58.42 51.42,58.42 VR6.P$2
N$56  (via drill 0.35)
  Top 0.254: v38.42,57.15 43.56,57.15 44.19,56.52 48.24,56.52 VR6.P$1
  Bottom 0.254: R39.1 52.07,60.35 VR6.P$1 | U5.2 v38.42,57.15
N$57  (via drill 0.35)
  Top 0.254: v38.42,55.88 53.34,55.88 54.61,57.15 54.61,60.96 53.34,62.23 52.07,62.23 v49.53,64.77
  Bottom 0.254: R39.2 50.17,71.44 R40.1 v49.53,64.77 | U5.1 v38.42,55.88
N$58  (via drill 0.35)
  Top 0.254: R41.1 13.02,77.15 v15.24,74.93 | v19.05,71.12 v44.45,71.12
  Bottom 0.254: C12.1 47.63,71.44 R40.2 | C12.1 46.99,60.35 VR6.P$3 46.34,60.31 43.18,57.15 U5.13 | v15.24,74.93 v19.05,71.12 | v44.45,71.12 46.67,71.12 C12.1
N$59  (via drill 0.35)
  Top 0.254: v48.26,68.58 46.99,68.58 45.72,69.85 45.72,72.39 v44.45,73.66 43.18,74.93 25.4,74.93 23.18,77.15 R42.1
  Bottom 0.254: v44.45,73.66 46.67,73.66 C12.2 | U5.14 41.97,55.9 47.86,55.9 48.25,56.29 48.25,66.03 48.26,66.04 v48.26,68.58
N$60
  Top 0.254: R42.2 16.11,72.31 OUT_2B.P$1_TIP 14.37,72.31 R41.2
N$61  (via drill 0.35)
  Top 0.254: v38.42,29.21 46.96,29.21 53.32,35.58 53.32,42.51 VR7.P$1
  Bottom 0.254: R43.1 52.07,43.84 VR7.P$1 | U7.6 v38.42,29.21
N$62  (via drill 0.35)
  Top 0.254: v38.1,31.75 43.18,36.83 44.45,36.83 45.72,38.1 45.72,46.99 v49.53,50.8
  Bottom 0.254: R43.2 50.17,54.93 R44.1 v49.53,50.8 | U7.7 36.83,30.48 v38.1,31.75
N$63  (via drill 0.35)
  Top 0.254: R46.1 13.02,60.64 v15.24,58.42 | v19.05,54.61 v44.45,54.61 | v45.72,31.75 48.26,31.75 50.8,34.29 50.8,41.91 48.92,41.91 VR7.P$3
  Bottom 0.254: C13.1 47.63,54.93 R44.2 | C13.1 46.99,43.84 VR7.P$3 | v15.24,58.42 v19.05,54.61 | v44.45,54.61 46.67,54.61 C13.1 | U7.9 43.18,29.21 v45.72,31.75
N$64  (via drill 0.35)
  Top 0.254: R45.1 23.18,60.64 25.4,58.42 43.18,58.42 v44.45,57.15 | v44.45,48.38 v44.45,41.91
  Bottom 0.254: C13.2 46.67,57.15 v44.45,57.15 43.76,56.46 40.75,56.46 40.59,56.3 40.59,55.46 40.75,55.3 42.49,55.3 43.18,54.61 43.18,49.65 v44.45,48.38 | U7.8 43.18,31.69 43.18,38.47 43.63,38.92 | 43.67,38.95 43.63,38.92 | 43.63,38.92 43.63,41.09 v44.45,41.91
N$65
  Top 0.254: R45.2 16.11,55.8 OUT_2C.P$1_TIP 14.37,55.8 R46.2
N$66  (via drill 0.35)
  Top 0.254: 52.07,27.25 52.07,26.67 | 52.07,27.25 VR8.P$1 52.07,27.25 | v38.42,24.13 46.99,24.13 48.26,22.86 50.8,22.86 52.07,24.13 52.07,27.25
  Bottom 0.254: R47.1 52.07,27.33 VR8.P$1 | U7.2 v38.42,24.13
N$67  (via drill 0.35)
  Top 0.254: v38.35,22.35 54.1,22.35 55.88,24.13 55.88,39.37 v54.86,40.39
  Bottom 0.254: R48.1 50.17,38.42 R47.2 52.14,40.39 v54.86,40.39 | U7.1 37.85,22.86 v38.35,22.35
N$68  (via drill 0.35)
  Top 0.254: R49.1 13.02,44.13 v15.24,41.91 | v19.05,38.1 v44.45,38.1
  Bottom 0.254: 46.99,38.22 46.99,27.33 VR8.P$3 43.8,27.29 43.35,26.84 43.35,24.3 43.18,24.13 U7.13 | 46.99,38.22 C14.1 47.63,38.42 R48.2 | v15.24,41.91 v19.05,38.1 | v44.45,38.1 46.87,38.1 46.99,38.22
N$69  (via drill 0.35)
  Top 0.254: R50.1 23.18,44.13 25.4,41.91 43.18,41.91 v44.45,40.64 | v48.26,35.56 48.26,40.64 v46.99,41.91
  Bottom 0.254: v44.45,40.64 46.67,40.64 46.91,40.4 | 46.91,40.4 C14.2 | U7.14 43.18,22.86 44.45,24.13 44.45,25.4 45.12,26.07 48.09,26.07 48.26,26.25 v48.26,35.56 | v46.99,41.91 46.99,40.48 46.91,40.4
N$70
  Top 0.254: R50.2 16.11,39.29 OUT_2D.P$1_TIP 14.37,39.29 R49.2
N$71  (via drill 0.35)
  Top 0.254: v53.34,31.75 50.8,31.75 49.53,30.48 VR8.P$2
  Bottom 0.254: R12.2 53.66,31.43 v53.34,31.75
N$72
  Bottom 0.254: R11.2 53.66,42.23 53.34,41.91 50.8,41.91 49.53,43.18 VR7.P$2
V+  (via drill 0.35)
  Top 0.254: v41.91,99.06 v40.64,97.79 | v33.02,104.14 v36.83,104.14 | v38.86,19.3 38.48,18.92 38.48,11.94 | 38.48,11.94 v38.86,11.56 | 38.48,11.94 38.41,11.94 C4.1
  Bottom 0.254: C3.1 27.94,102.87 27.3,103.5 U1.8 27.36,104.14 v33.02,104.14 | v41.91,99.06 43.18,100.33 C1.1 42.55,101.28 D1.C 41.91,102.87 40.64,104.14 v36.83,104.14 | v40.64,97.79 39.05,96.2 39.05,76.83 | 39.05,76.83 38.1,76.2 U4.4 | 39.05,70.44 39.05,76.83 | 39.05,70.44 39.05,60.33 | 39.05,60.33 38.1,59.69 U5.4 | 39.05,54.03 39.05,60.33 | 39.05,54.03 39.05,43.81 | 39.05,43.81 38.1,43.18 U6.4 | 39.05,37.46 39.05,43.81 | 39.05,37.46 39.05,27.3 | 39.05,27.3 38.1,26.67 U7.4 | 39.05,70.44 39,70.48 38.37,70.17 C23.1 | 39.05,27.3 39.05,21.16 | C22.1 38.36,53.66 39.05,54.03 | C21.1 38.42,37.15 39.05,37.46 | C20.1 38.21,20.64 39.05,21.16 | 39.05,21.16 39.05,19.49 v38.86,19.3 | v38.86,11.56 38.86,11.43 39.37,10.92 U2.4
V-  (via drill 0.35)
  Top 0.254: v39.88,19.3 39.88,16.89 v39.49,16.51 C7.2
  Bottom 0.254: 23.5,99.69 U1.4 | 23.5,99.69 22.86,100.33 C6.2 | 23.5,99.69 25.4,101.6 38.1,101.6 43.5,96.2 C2.2 42.55,94.3 D2.A 41.91,92.71 39.69,91.12 39.69,76.83 | 39.69,76.83 40.64,76.2 U4.11 | 39.69,70.52 39.69,76.83 | 39.69,70.52 39.69,60.33 | 39.69,60.33 40.64,59.69 U5.11 | 39.69,53.97 39.69,60.33 | 39.69,53.97 39.69,43.81 | 39.69,43.81 40.64,43.18 U6.11 | 39.69,37.49 39.69,43.81 | 39.69,37.49 39.69,27.3 | 39.69,27.3 40.64,26.67 U7.11 | 40.01,53.98 39.69,53.97 | 39.69,27.3 39.69,21.32 | C18.2 40.04,70.17 39.69,70.52 | C17.2 40.32,53.66 39.69,53.97 | C16.2 40.03,37.15 39.69,37.49 | C15.2 40.37,20.64 39.69,21.32 | 39.69,21.32 39.69,19.49 v39.88,19.3 | v39.49,16.51 39.49,14.92 U2.11

### Text on the board
tPlace: E:/Downloads/Logo-04.bmp
tNames: Attenumults | CC-BY-SA: / Matt Gaines | 1k | 100k | 1k | 100k